# Altium project My-ESP32-Proj.PrjPcb
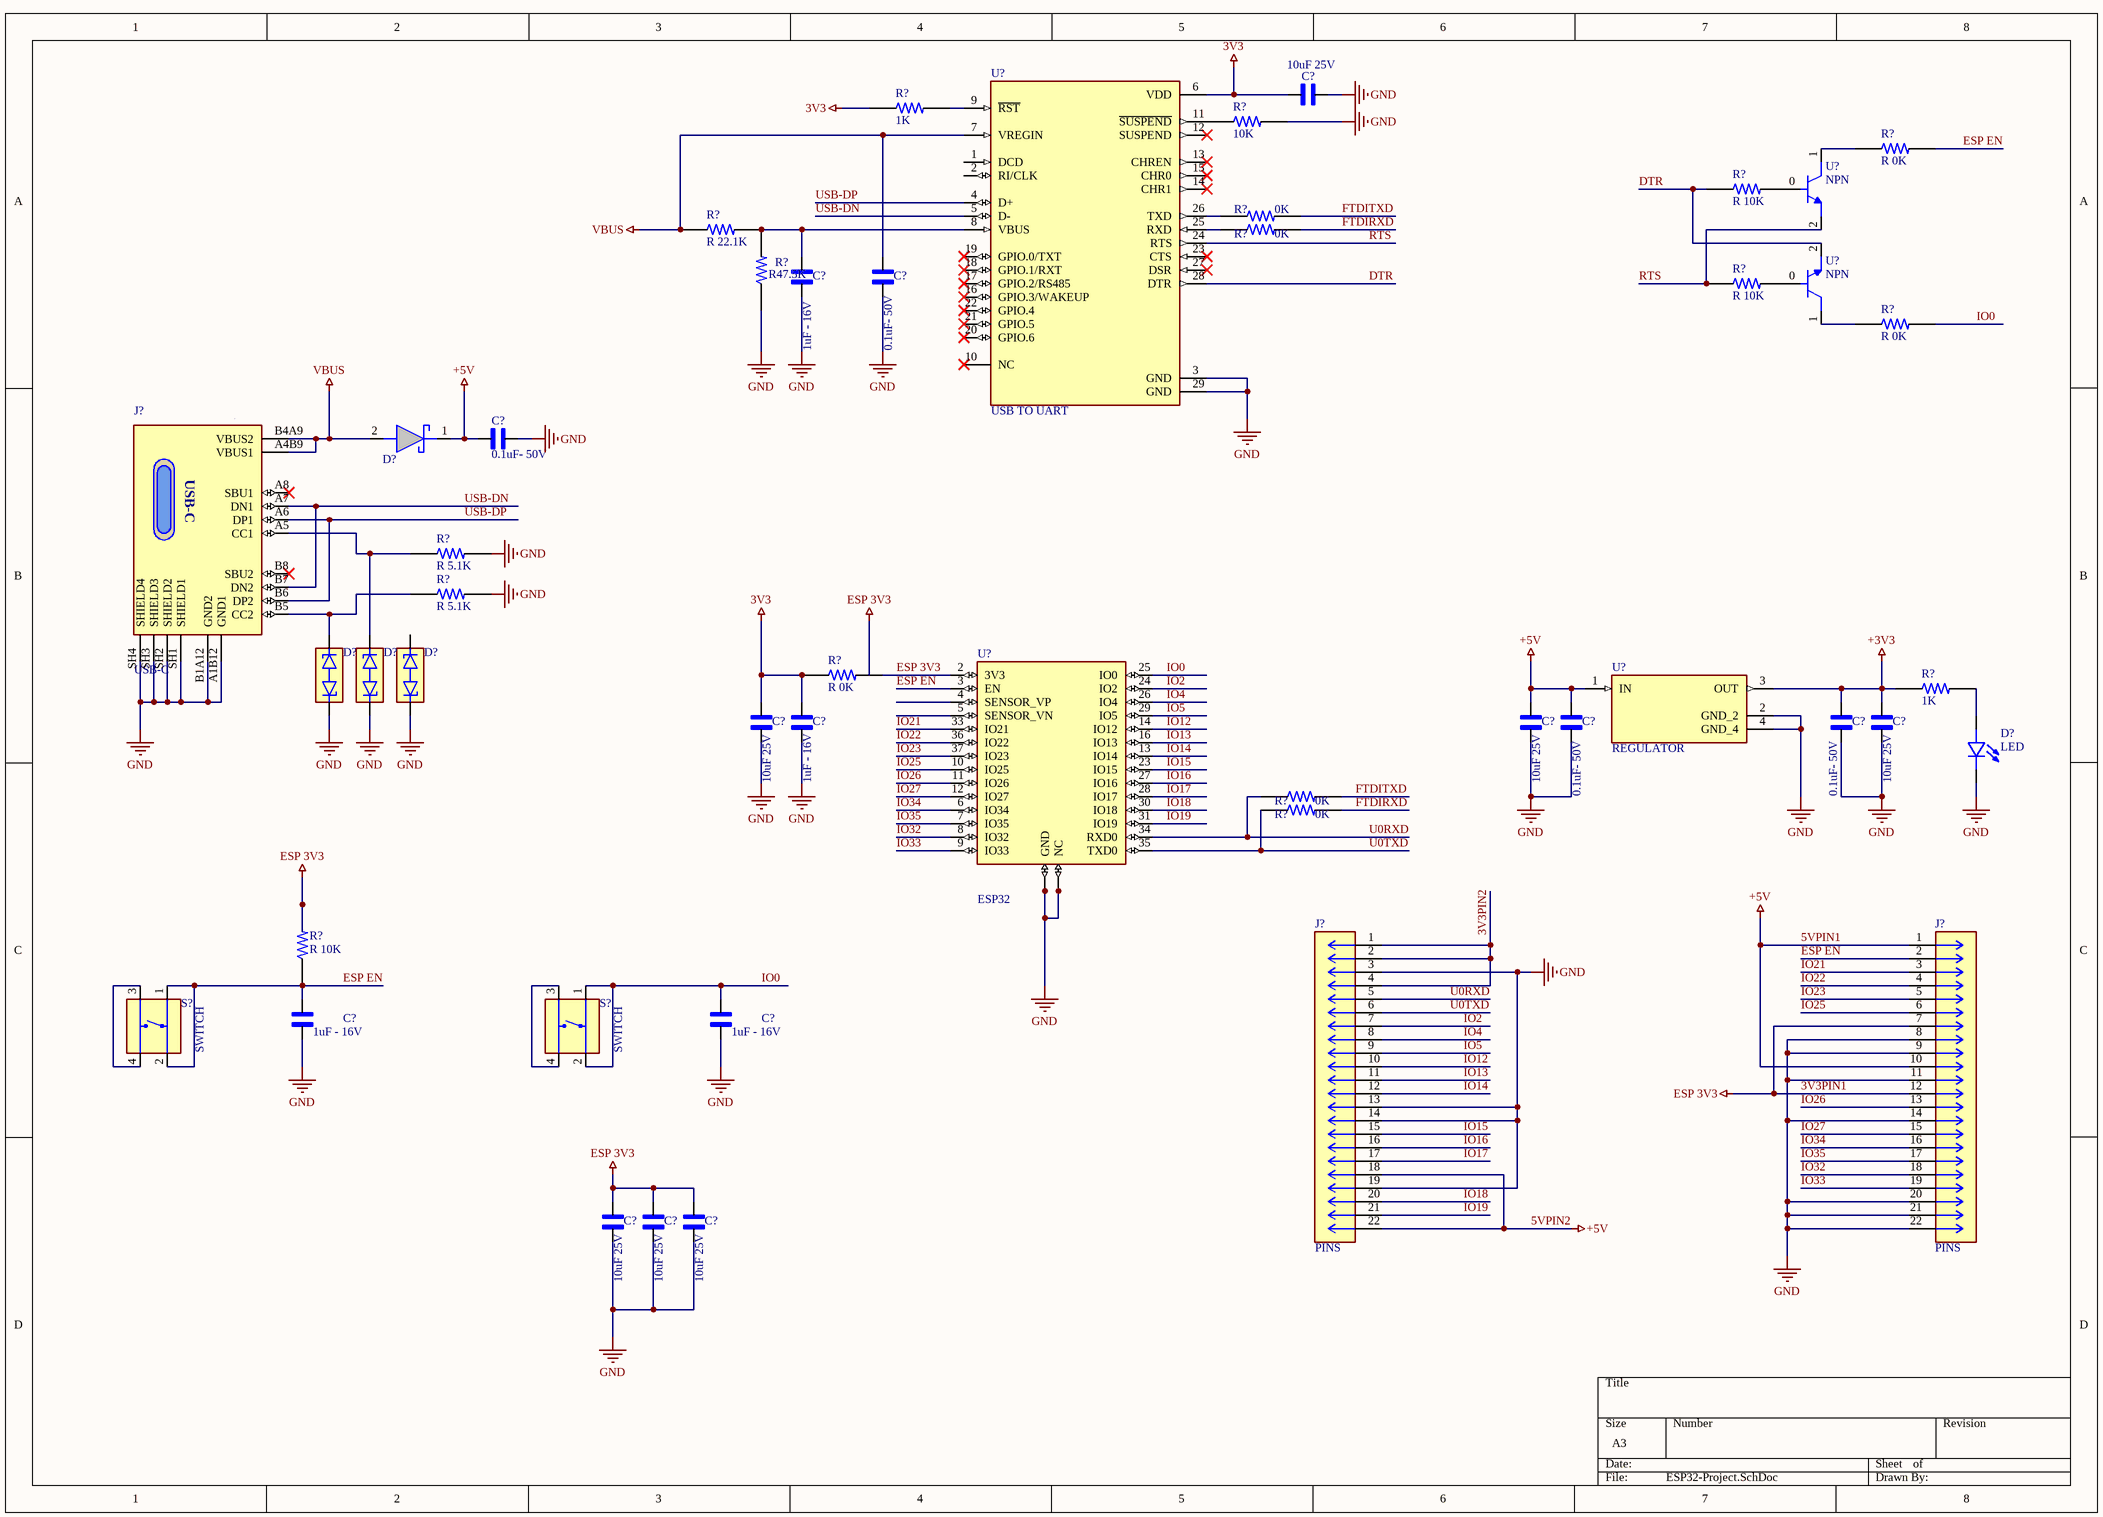
[diagram p0: ESP32-Project.SchDoc]
1 sheet, 47 parts. Net scope: global (net labels, ports and power ports of the same name join across sheets).
Board file: ESP32-Project.PcbDoc

## Sheet ESP32-Project.SchDoc
size A3; SheetNumber: 1; SheetTotal: 1

### Parts
(Parts that share a designator on the sheet are numbered #1, #2 ... from top to bottom, then left to right.)
C?#1  10uF 25V  [CAPC3216X180N]
C?#2  0.1uF- 50V  [CAPC1005X55N]
C?#3  1uF - 16V  [CAPC1608X90N]
C?#4  0.1uF- 50V  [CAPC1005X55N]
C?#5  10uF 25V  [CAPC3216X180N]
C?#6  1uF - 16V  [CAPC1608X90N]
C?#7  10uF 25V  [CAPC3216X180N]
C?#8  0.1uF- 50V  [CAPC1005X55N]
C?#9  0.1uF- 50V  [CAPC1005X55N]
C?#10  10uF 25V  [CAPC3216X180N]
C?#11  1uF - 16V  [CAPC1608X90N]
C?#12  1uF - 16V  [CAPC1608X90N]
C?#13  10uF 25V  [CAPC3216X180N]
C?#14  10uF 25V  [CAPC3216X180N]
C?#15  10uF 25V  [CAPC3216X180N]
D?#1  1N5819HW1-7-F  [SODFL3518X115N]  (value not drawn)
D?#2  PESD1LIN  [DIO_PESD1LIN]  (value not drawn)
D?#3  PESD1LIN  [DIO_PESD1LIN]  (value not drawn)
D?#4  PESD1LIN  [DIO_PESD1LIN]  (value not drawn)
D?#5  LED  [LED_APT1608SGC]
J?#1  USB-C  [MOLEX_2171790001]
J?#2  PINS  [CONN_SD-42375-001_M320_22_MOL]
J?#3  PINS  [CONN_SD-42375-001_M320_22_MOL]
R?#1  1K  [RESC1005X40N-1K]
R?#2  10K  [RESC1005X40N]
R?#3  R 0K  [RESC1005X40]
R?#4  R 10K  [RESC1005X40N]
R?#5  0K  [RESC1005X40]
R?#6  R 22.1K  [RESC1005X40N-22.1]
R?#7  0K  [RESC1005X40]
R?#8  R 10K  [RESC1005X40N]
R?#9  R47.5K  [RES_ERA3AEB4752V]
R?#10  R 0K  [RESC1005X40]
R?#11  R 5.1K  [RESC1005X40N]
R?#12  R 5.1K  [RESC1005X40N]
R?#13  R 0K  [RESC1005X40]
R?#14  1K  [RESC1005X40N-1K]
R?#15  0K  [RESC1005X40]
R?#16  0K  [RESC1005X40]
R?#17  R 10K  [RESC1005X40N]
S?#1  SWITCH  [SW_PTS645SK50SMTR92LFS]
S?#2  SWITCH  [SW_PTS645SK50SMTR92LFS]
U?#1  NPN  [SOT91P240X110-3N]
U?#2  USB TO UART  [QFN50P500X500X80-29N]
U?#3  NPN  [SOT91P240X110-3N]
U?#4  ESP32  [ESP32WROOM32EN8]
U?#5  REGULATOR  [VREG_TL1963A-33DCYR]

### Nets
3V3: C?#1.2 C?#5.2 C?#6.2 R?#1.1 R?#13.1 U?#2.6(VDD)
3V3PIN1: C?#13.2 C?#14.2 C?#15.2 J?#3.7 J?#3.12 R?#13.2 R?#17.2 U?#4.2(3V3)  [also labelled ESP 3V3]
5VPIN1: C?#4.2 C?#7.2 C?#8.2 D?#1.1(K) J?#2.18 J?#2.22 J?#3.1 J?#3.10 U?#5.1(IN)  [also labelled +5V, 5VPIN2]
+3V3: C?#9.2 C?#10.2 R?#14.1 U?#5.3(OUT)
GND: C?#1.1 C?#2.2 C?#3.1 C?#4.1 C?#5.1 C?#6.1 C?#7.1 C?#8.1 C?#9.1 C?#10.1 C?#11.1 C?#12.1 C?#13.1 C?#14.1 C?#15.1 D?#2.1 D?#3.1 D?#4.1 D?#5.1(C) J?#1.A1B12(GND1) J?#1.B1A12(GND2) J?#1.SH1(SHIELD1) J?#1.SH2(SHIELD2) J?#1.SH3(SHIELD3) J?#1.SH4(SHIELD4) J?#2.3 J?#2.13 J?#2.14 J?#2.19 J?#3.8 J?#3.9 J?#3.11 J?#3.14 J?#3.20 J?#3.21 J?#3.22 R?#2.2 R?#9.1 R?#11.2 R?#12.2 U?#2.3(GND) U?#2.29(GND) U?#4.1(GND) U?#4.15(GND) U?#4.17(NC) U?#4.18(NC) U?#4.19(NC) U?#4.20(NC) U?#4.21(NC) U?#4.22(NC) U?#4.32(NC) U?#4.38(GND) U?#4.39(GND) U?#4.40(GND) U?#4.41(GND) U?#4.42(GND) U?#4.43(GND) U?#4.44(GND) U?#4.45(GND) U?#4.46(GND) U?#4.47(GND) U?#5.2(GND_2) U?#5.4(GND_4)
VBUS: C?#2.1 D?#1.2(A) J?#1.A4B9(VBUS1) J?#1.B4A9(VBUS2) R?#6.1 U?#2.7(VREGIN)
3V3PIN2: J?#2.1 J?#2.2 J?#2.4
DTR: R?#4.1 U?#2.28(DTR) U?#3.2
ESP EN: C?#11.2 J?#3.2 R?#3.2 R?#17.1 S?#1.1 S?#1.2 U?#4.3(EN)
FTDIRXD: R?#7.2 R?#16.2
FTDITXD: R?#5.2 R?#15.2
IO0: C?#12.2 R?#10.2 S?#2.1 S?#2.2 U?#4.25(IO0)
IO2: J?#2.7 U?#4.24(IO2)
IO4: J?#2.8 U?#4.26(IO4)
IO5: J?#2.9 U?#4.29(IO5)
IO12: J?#2.10 U?#4.14(IO12)
IO13: J?#2.11 U?#4.16(IO13)
IO14: J?#2.12 U?#4.13(IO14)
IO15: J?#2.15 U?#4.23(IO15)
IO16: J?#2.16 U?#4.27(IO16)
IO17: J?#2.17 U?#4.28(IO17)
IO18: J?#2.20 U?#4.30(IO18)
IO19: J?#2.21 U?#4.31(IO19)
IO21: J?#3.3 U?#4.33(IO21)
IO22: J?#3.4 U?#4.36(IO22)
IO23: J?#3.5 U?#4.37(IO23)
IO25: J?#3.6 U?#4.10(IO25)
IO26: J?#3.13 U?#4.11(IO26)
IO27: J?#3.15 U?#4.12(IO27)
IO32: J?#3.18 U?#4.8(IO32)
IO33: J?#3.19 U?#4.9(IO33)
IO34: J?#3.16 U?#4.6(IO34)
IO35: J?#3.17 U?#4.7(IO35)
RTS: R?#8.1 U?#1.2 U?#2.24(RTS)
U0RXD: J?#2.5 R?#15.1 U?#4.34(RXD0)
U0TXD: J?#2.6 R?#16.1 U?#4.35(TXD0)
USB-DN: J?#1.A7(DN1) J?#1.B7(DN2) U?#2.5(D-)
USB-DP: J?#1.A6(DP1) J?#1.B6(DP2) U?#2.4(D+)
NetC?#3_2: C?#3.2 R?#6.2 R?#9.2 U?#2.8(VBUS)
NetD?#2_2: D?#2.2 J?#1.B5(CC2) R?#12.1
NetD?#3_2: D?#3.2 J?#1.A5(CC1) R?#11.1
NetD?#5_2: D?#5.2(A) R?#14.2
NetR?#1_2: R?#1.2 U?#2.9(~{RST})
NetR?#2_1: R?#2.1 U?#2.11(~{SUSPEND})
NetR?#3_1: R?#3.1 U?#1.1
NetR?#4_2: R?#4.2 U?#1.0
NetR?#5_1: R?#5.1 U?#2.26(TXD)
NetR?#7_1: R?#7.1 U?#2.25(RXD)
NetR?#8_2: R?#8.2 U?#3.0
NetR?#10_1: R?#10.1 U?#3.1
NetS?#1_3: S?#1.3 S?#1.4
NetS?#2_3: S?#2.3 S?#2.4

Not connected (* = marked no-connect by the designer): D?#4 2; J?#1 A8(SBU1)* B8(SBU2)*; U?#2 1(DCD) 2(RI/CLK) 10(NC)* 12(SUSPEND)* 13(CHREN)* 14(CHR1)* 15(CHR0)* 16(GPIO.3/WAKEUP)* 17(GPIO.2/RS485)* 18(GPIO.1/RXT)* 19(GPIO.0/TXT)* 20(GPIO.6)* 21(GPIO.5)* 22(GPIO.4)* 23(CTS)* 27(DSR)*; U?#4 4(SENSOR_VP) 5(SENSOR_VN)

### Library data of the parts
C?#1 C?#5 C?#7 C?#10 C?#13-C?#15 = C-10uF-25V: CL31 Series 10 uF 25 V Â±10 % Tolerance X7R SMT Multilayer Ceramic Capacitor; MF: Samsung Electro-Mechanics; MP: CL31B106KAHNNNE; SnapEDA_Link: https://www.snapeda.com/parts/CL31B106KAHNNNE/Samsung/view-part/?ref=snap; Package: SMD-2 Samsung; Value: *; Check_prices: https://www.snapeda.com/parts/CL31B106KAHNNNE/Samsung/view-part/?ref=eda
C?#2 C?#4 C?#8 C?#9 = C-0.1uF- 50V: 0.1 ÂµF Â±10% 50V Ceramic Capacitor X7R 0402 (1005 Metric); MF: Samsung Electro-Mechanics; MP: CL05B104KB5NNNC; SnapEDA_Link: https://www.snapeda.com/parts/CL05B104KB5NNNC/Samsung/view-part/?ref=snap; Package: SMD-2 Samsung; Value: *; Check_prices: https://www.snapeda.com/parts/CL05B104KB5NNNC/Samsung/view-part/?ref=eda
C?#3 C?#6 C?#11 C?#12 = C-1uF-16V: 1 ÂµF Â±10% 16V Ceramic Capacitor X7R 0603 (1608 Metric); MF: Samsung Electro-Mechanics; MP: CL10B105KO8NNNC; SnapEDA_Link: https://www.snapeda.com/parts/CL10B105KO8NNNC/Samsung/view-part/?ref=snap; Package: SMD-2 Samsung; Value: *; Check_prices: https://www.snapeda.com/parts/CL10B105KO8NNNC/Samsung/view-part/?ref=eda
D?#1 = diode: 1N5819 Schottky Diode 40V 1A SOD123F; Manufacturer_Name: Diodes Incorporated; Geometry.Height: 1.15mm; Mouser Part Number: 621-1N5819HW1-7-F; Mouser Price/Stock: https://www.mouser.co.uk/ProductDetail/Diodes-Incorporated/1N5819HW1-7-F?qs=60RJRzIpcl9ACQG7Zn63jQ%3D%3D; Manufacturer_Part_Number: 1N5819HW1-7-F; Datasheet Link: https://www.diodes.com//assets/Datasheets/1N5819HW1.pdf
D?#2-D?#4 = PESD1LIN: 44V, 70V Clamp 3A (8/20Âµs) Ipp Tvs Diode Surface Mount SOD-323; MF: Nexperia USA; SnapEDA_Link: https://www.snapeda.com/parts/PESD1LIN/Nexperia/view-part/?ref=snap; Package: SOD-323 Vishay Semiconductor Diodes Division; Value: *; MP: PESD1LIN; Check_prices: https://www.snapeda.com/parts/PESD1LIN/Nexperia/view-part/?ref=eda
D?#5 = LED: Green 568nm LED Indication - Discrete 2.2V 0603 (1608 Metric); MF: Kingbright; MP: APT1608SGC; SnapEDA_Link: https://www.snapeda.com/parts/APT1608SGC/Kingbright/view-part/?ref=snap; Package: 0603 Kingbright; Value: *; Check_prices: https://www.snapeda.com/parts/APT1608SGC/Kingbright/view-part/?ref=eda
J?#1 = USB-C: USB Type C - Connector, Top-mount SMT, 16pos | Molex Incorporated 217179-0001; SnapEDA_Link: https://www.snapeda.com/parts/217179-0001/Molex/view-part/?ref=snap; Package: None; Value: *; MF: Molex; MP: 217179-0001; Check_prices: https://www.snapeda.com/parts/217179-0001/Molex/view-part/?ref=eda
J?#2 J?#3 = PINS: MP: 22284221; Package: None; Price: None; Value: *; Availability: Unavailable
R?#1 R?#14 = R 1K: 1 kOhms Â±1% 0.063W, 1/16W Chip Resistor 0402 (1005 Metric) Moisture Resistant Thick Film; MF: Yageo Corporation; MP: RC0402FR071KL; SnapEDA_Link: https://www.snapeda.com/parts/RC0402FR071KL/Yageo/view-part/?ref=snap; Package: 0402-2 YAGEO; Value: *; Check_prices: https://www.snapeda.com/parts/RC0402FR071KL/Yageo/view-part/?ref=eda
R?#2 R?#4 R?#8 R?#17 = R10K: 10 kOhms Â±1% 0.063W, 1/16W Chip Resistor 0402 (1005 Metric) Moisture Resistant Thick Film; MF: Yageo; MP: RC0402FR-0710KP; SnapEDA_Link: https://www.snapeda.com/parts/RC0402FR-0710KP/Yageo/view-part/?ref=snap; Package: 1005 Panasonic Electronic Components; Value: *; Check_prices: https://www.snapeda.com/parts/RC0402FR-0710KP/Yageo/view-part/?ref=eda
R?#3 R?#5 R?#7 R?#10 R?#13 R?#15 R?#16 = R 0K: 0 Ohms Jumper 0.063W, 1/16W Chip Resistor 0402 (1005 Metric) Moisture Resistant Thick Film; MF: Yageo; MP: RC0402JR-070RL; Purchase-URL: https://pricing.snapeda.com/search/part/RC0402JR-070RL/?ref=eda; Package: 0402 Yageo; Digi-Key_Part_Number: 311-0.0JRTR-ND; Check_prices: https://www.snapeda.com/parts/RC0402JR-070RL/Yageo/view-part/?ref=eda; Value: *; SnapEDA_Link: https://www.snapeda.com/parts/RC0402JR-070RL/Yageo/view-part/?ref=snap
R?#6 = R 22.1K: 22.1 kOhms Â±1% 0.1W, 1/10W Chip Resistor 0402 (1005 Metric) Automotive AEC-Q200, Moisture Resistant Thick Film; MF: KOA Speer; MP: RK73H1ETTP2212F; SnapEDA_Link: https://www.snapeda.com/parts/RK73H1ETTP2212F/KOA+Speer/view-part/?ref=snap; Package: 0402 KOA; Value: *; Check_prices: https://www.snapeda.com/parts/RK73H1ETTP2212F/KOA+Speer/view-part/?ref=eda
R?#9 = R47.5K: MP: ERA3AEB4752V; Value: *; Package: None; Availability: Unavailable; Price: None
R?#11 R?#12 = R 5.1K: 5.1 kOhms Â±1% 0.063W, 1/16W Chip Resistor 0402 (1005 Metric) Moisture Resistant Thick Film; MF: Yageo; MP: RC0402FR-075K1L; SnapEDA_Link: https://www.snapeda.com/parts/RC0402FR-075K1L/Yageo/view-part/?ref=snap; Package: 1005 Panasonic Electronic Components; Value: *; Check_prices: https://www.snapeda.com/parts/RC0402FR-075K1L/Yageo/view-part/?ref=eda
S?#1 S?#2 = SW: Switch;Tactile;SPST-NO;OFF-MOM;Top Actuator;260 Grams;4.3mm;.05A;12VDC;Gull Wing | C&K PTS645SK50SMTR92 LFS; SnapEDA_Link: https://www.snapeda.com/parts/PTS645SK50SMTR92%20LFS/C%2526K/view-part/?ref=snap; Package: None; Value: *; MF: C&K; MP: PTS645SK50SMTR92 LFS; Check_prices: https://www.snapeda.com/parts/PTS645SK50SMTR92%20LFS/C%2526K/view-part/?ref=eda
U?#2 = USB TO UART: USB Bridge, USB to UART USB 2.0 UART Interface 28-QFN (5x5); MF: Silicon Labs; MP: CP2102N-A02-GQFN28; Value: *; Price: None; Package: WFQFN-28 Silicon Labs; Check_prices: https://www.snapeda.com/parts/CP2102N-A02-GQFN28/Silicon+Labs/view-part/?ref=eda; Availability: In Stock; SnapEDA_Link: https://www.snapeda.com/parts/CP2102N-A02-GQFN28/Silicon+Labs/view-part/?ref=snap; Purchase-URL: https://pricing.snapeda.com/search/part/CP2102N-A02-GQFN28/?ref=eda
U?#5 = REGULATOR: 1.5-A, 20-V, low-dropout voltage regulator with reverse current & reverse voltage protection; MF: Texas Instruments; MP: TL1963A-33DCYR; SnapEDA_Link: https://www.snapeda.com/parts/TL1963A-33DCYR/Texas+Instruments/view-part/?ref=snap; Package: SOT-223-4 Texas Instruments; Value: *; Check_prices: https://www.snapeda.com/parts/TL1963A-33DCYR/Texas+Instruments/view-part/?ref=eda